# Altium schematic sheet ECU_Sheet.SchDoc
size 420 x 297 mm; SheetNumber: 1; SheetTotal: 5
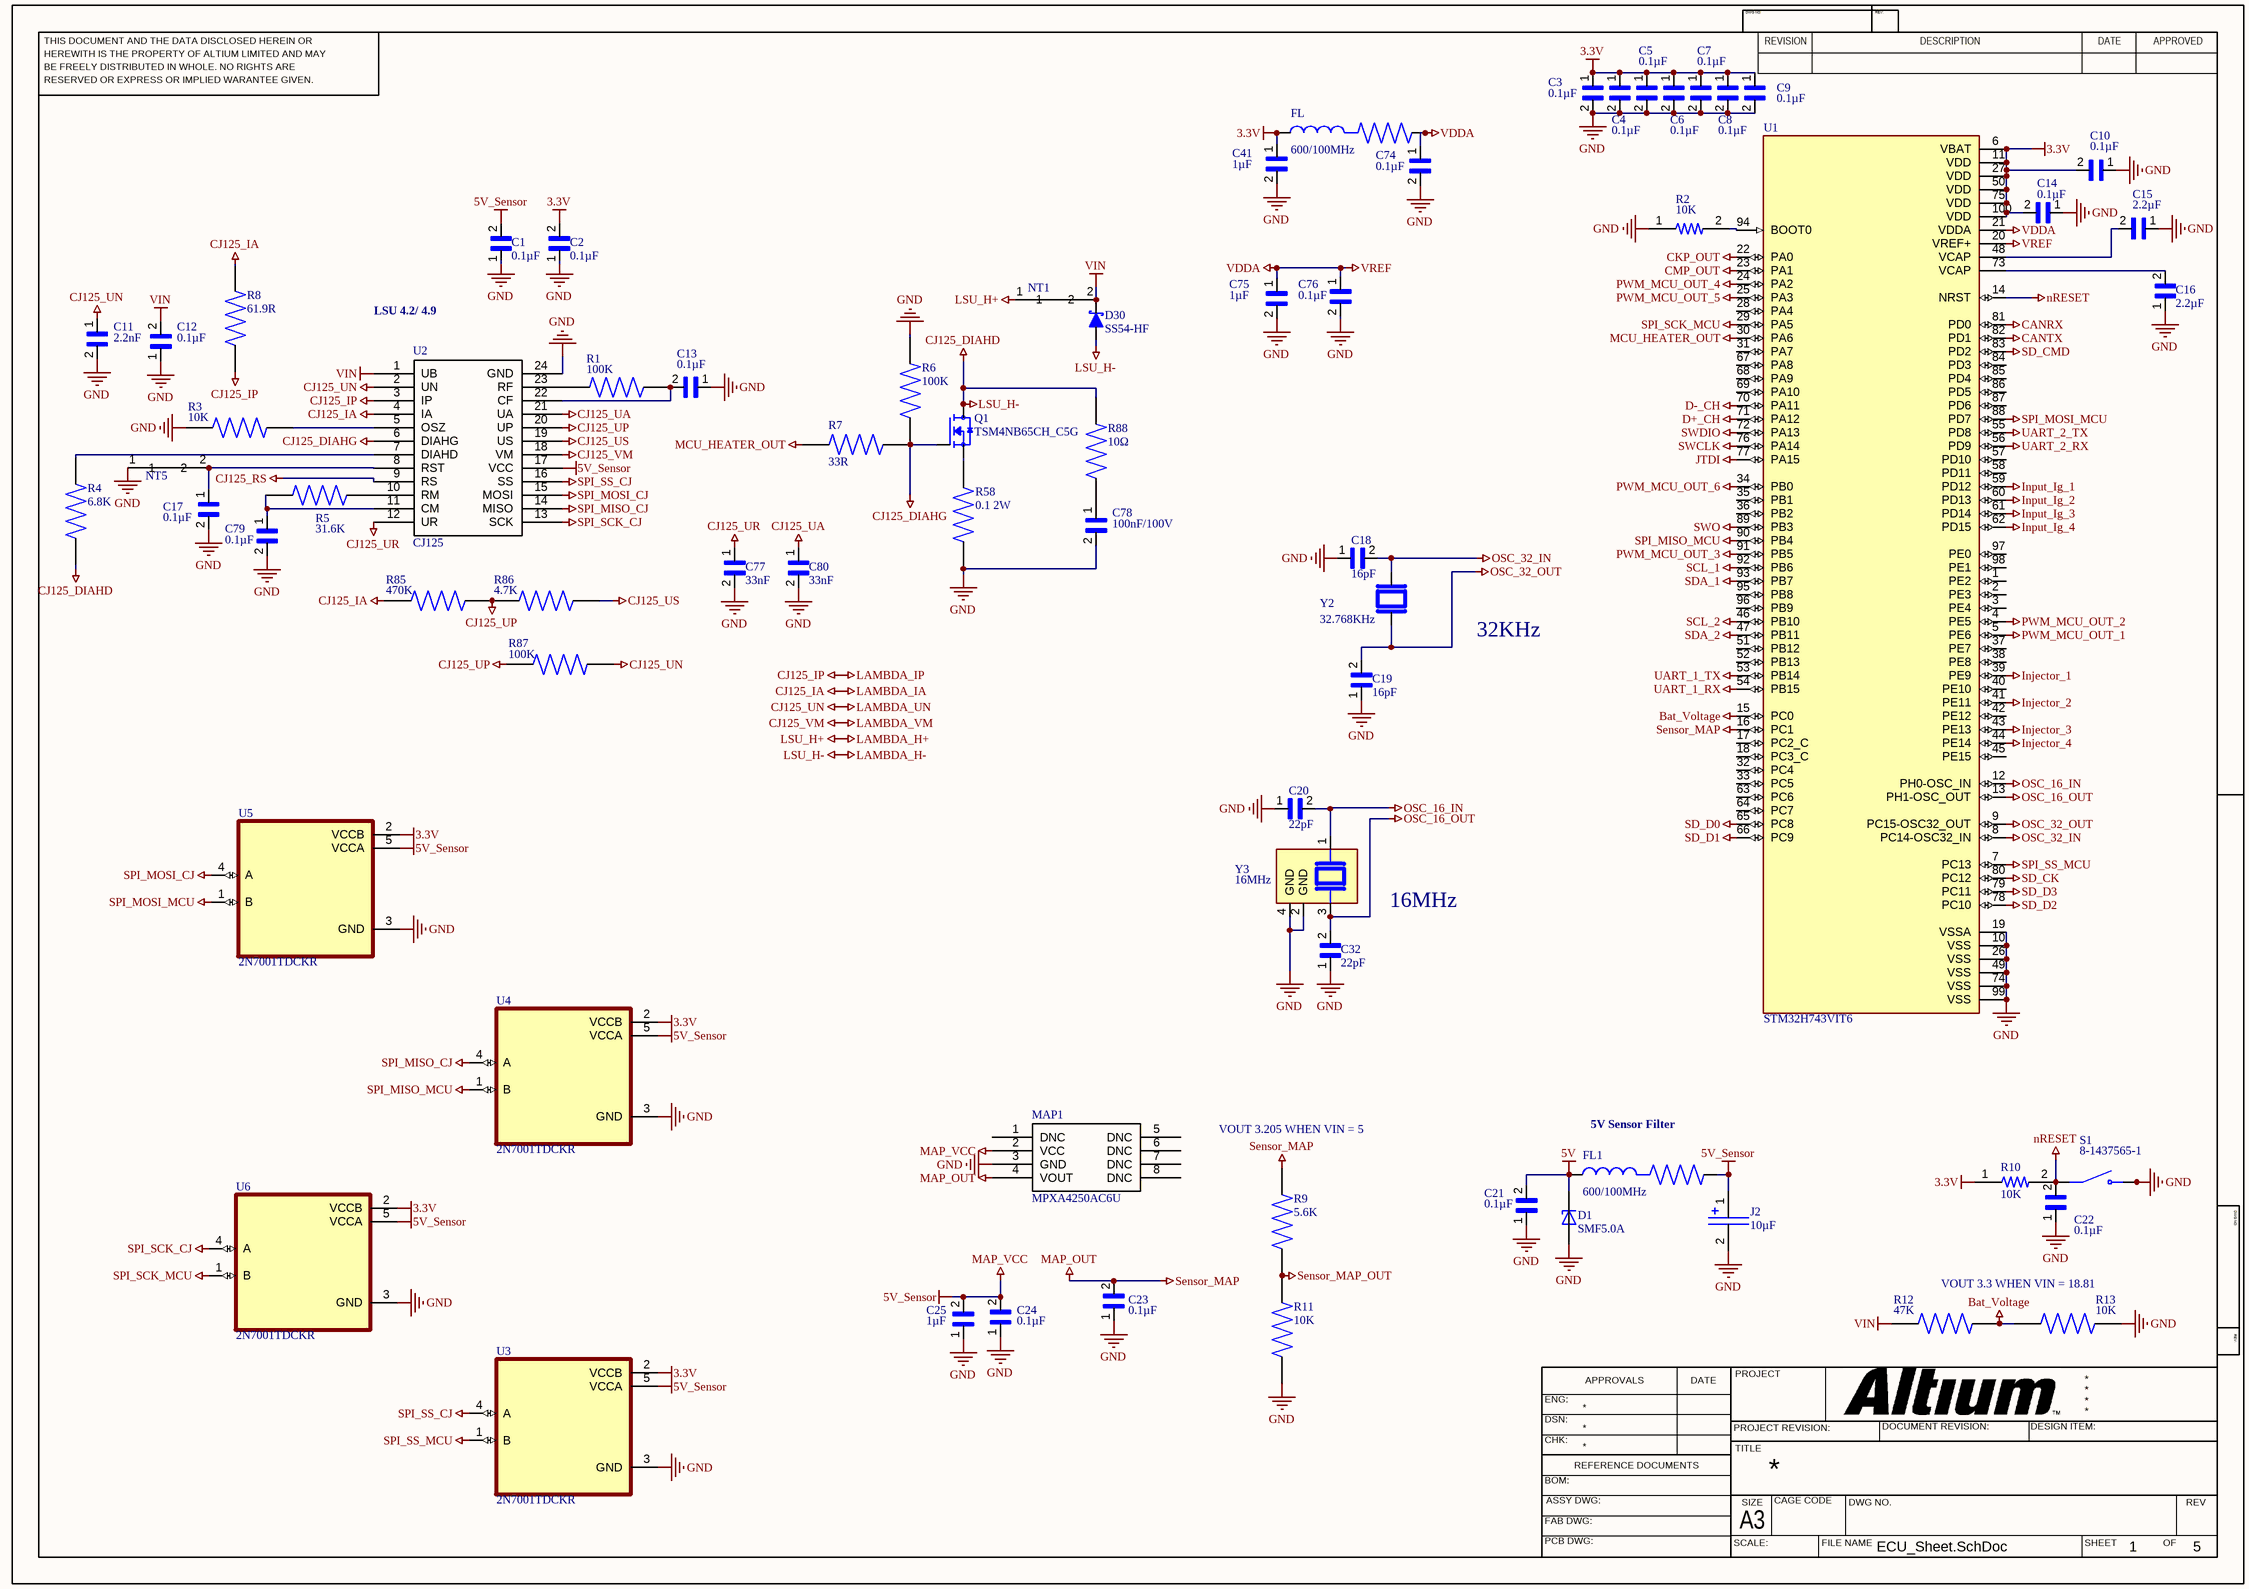
[diagram p0: ECU_Sheet.SchDoc]

## Parts
C1  0.1µF  [CAPC1608X90N]
C2  0.1µF  [CAPC1608X90N]
C3  0.1µF  [CAPC1608X90N]
C4  0.1µF  [CAPC1608X90N]
C5  0.1µF  [CAPC1608X90N]
C6  0.1µF  [CAPC1608X90N]
C7  0.1µF  [CAPC1608X90N]
C8  0.1µF  [CAPC1608X90N]
C9  0.1µF  [CAPC1608X90N]
C10  0.1µF  [CAPC1608X90N]
C11  2.2nF  [CAPC1608X90N]
C12  0.1µF  [CAPC1608X90N]
C13  0.1µF  [CAPC1608X90N]
C14  0.1µF  [CAPC1608X90N]
C15  2.2µF  [CAPC1608X90N]
C16  2.2µF  [CAPC1608X90N]
C17  0.1µF  [CAPC1608X90N]
C18  16pF  [CAPC1608X90N]
C19  16pF  [CAPC1608X90N]
C20  22pF  [CAPC1608X90N]
C21  0.1µF  [CAPC1608X90N]
C22  0.1µF  [CAPC1608X90N]
C23  0.1µF  [CAPC1608X90N]
C24  0.1µF  [CAPC1608X90N]
C25  1µF  [CAPC1608X90N]
C32  22pF  [CAPC1608X90N]
C41  1µF  [CAPC1608X90N]
C74  0.1µF  [CAPC1608X90N]
C75  1µF  [CAPC1608X90N]
C76  0.1µF  [CAPC1608X90N]
C77  33nF  [CAPC1608X90N]
C78  100nF/100V  [CAPC1608X90N]
C79  0.1µF  [CAPC1608X90N]
C80  33nF  [CAPC1608X90N]
D1  SMF5.0A  [SODFL3718X102N]
D30  SS54-HF  [DIOM5025X220N]
FL  600/100MHz  [BEADC1608X95N]
FL1  600/100MHz  [BEADC1608X95N]
J2  10µF  [T491A106K010AT]
MAP1  MPXA4250AC6U  [SOIC127P1041X990-8N]
NT1  (no value)  [NetTie]  (net tie, no BOM)
NT5  NT  [NetTie]  (value not drawn)  (net tie, no BOM)
Q1  TSM4NB65CH_C5G  [TO228P680X240X837-3]
R1  100K  [RESC3116X65N]
R2  10K  [RESC1608X50N]
R3  10K  [RESC3116X65N]
R4  6.8K  [RESC3116X65N]
R5  31.6K  [RESC3116X65N]
R6  100K  [RESC3116X65N]
R7  33R  [RESC3116X65N]
R8  61.9R  [RESC3116X65N]
R9  5.6K  [RESC3116X65N]
R10  10K  [RESC1608X50N]
R11  10K  [RESC3116X65N]
R12  47K  [RESC3116X65N]
R13  10K  [RESC3116X65N]
R58  0.1 2W  [RESC6331X80N]
R85  470K  [RESC3116X65N]
R86  4.7K  [RESC3116X65N]
R87  100K  [RESC3116X65N]
R88  10Ω  [RESC3116X65N]
S1  8-1437565-1  [SW_8-1437565-1]
U1  STM32H743VIT6  [QFP50P1600X1600X160-100N]
U2  CJ125  [CJ125]
U3  2N7001TDCKR  [SOT65P210X110-5N]
U4  2N7001TDCKR  [SOT65P210X110-5N]
U5  2N7001TDCKR  [SOT65P210X110-5N]
U6  2N7001TDCKR  [SOT65P210X110-5N]
Y2  32.768KHz  [XTAL_ABS06-32.768KHZ-9-1-T]
Y3  16MHz  [XTAL_7M25090002]

## Nets
3.3V: C2.2 C3.1 C4.1 C5.1 C6.1 C7.1 C8.1 C9.1 C10.2 C14.2 C41.1 FL.1 R10.1 U1.6(VBAT) U1.11(VDD) U1.27(VDD) U1.50(VDD) U1.75(VDD) U1.100(VDD) U3.2(VCCB) U4.2(VCCB) U5.2(VCCB) U6.2(VCCB)
5V: C21.2 D1.C FL1.1
5V_Sensor: C1.2 C24.2 C25.2 FL1.2 J2.1(P$1) MAP1.2(VCC) U2.17(VCC) U3.5(VCCA) U4.5(VCCA) U5.5(VCCA) U6.5(VCCA)  [also labelled MAP_VCC]
Bat_Voltage: R12.2 R13.1 U1.15(PC0)
CANRX: U1.81(PD0)
CANTX: U1.82(PD1)
CJ125_DIAHD: D30.2(A) Q1.2(D) R4.1 R88.2  [also labelled LAMBDA_H-, LSU_H-]
CJ125_DIAHG: Q1.1(G) R6.1 R7.2 U2.6(DIAHG)
CJ125_IA: R8.1 R85.1 U2.4(IA)  [also labelled LAMBDA_IA]
CJ125_IP: R8.2 U2.3(IP)  [also labelled LAMBDA_IP]
CJ125_RS: U2.9(RS)
CJ125_UA: C80.1 U2.21(UA)
CJ125_UN: C11.1 R87.2 U2.2(UN)  [also labelled LAMBDA_UN]
CJ125_UP: R85.2 R86.1 R87.1 U2.20(UP)
CJ125_UR: C77.1 U2.12(UR)
CJ125_US: R86.2 U2.19(US)
CJ125_VM: U2.18(VM)  [also labelled LAMBDA_VM]
CKP_OUT: U1.22(PA0)
CMP_OUT: U1.23(PA1)
D+_CH: U1.71(PA12)
D-_CH: U1.70(PA11)
GND: C1.1 C2.1 C3.2 C4.2 C5.2 C6.2 C7.2 C8.2 C9.2 C10.1 C11.2 C12.1 C13.1 C14.1 C15.1 C16.1 C17.2 C18.1 C19.1 C20.1 C21.1 C22.1 C23.1 C24.1 C25.1 C32.1 C41.2 C74.2 C75.2 C76.2 C77.2 C78.2 C79.2 C80.2 D1.A J2.2(P$2) MAP1.3(GND) NT5.1 R2.1 R3.1 R6.2 R11.1 R13.2 R58.2 S1.3(NO) S1.4(NO) U1.10(VSS) U1.19(VSSA) U1.26(VSS) U1.49(VSS) U1.74(VSS) U1.99(VSS) U2.24(GND) U3.3(GND) U4.3(GND) U5.3(GND) U6.3(GND) Y3.2(GND) Y3.4(GND)
Injector_1: U1.39(PE9)
Injector_2: U1.41(PE11)
Injector_3: U1.43(PE13)
Injector_4: U1.44(PE14)
Input_Ig_1: U1.59(PD12)
Input_Ig_2: U1.60(PD13)
Input_Ig_3: U1.61(PD14)
Input_Ig_4: U1.62(PD15)
JTDI: U1.77(PA15)
LAMBDA_H+: NT1.1  [also labelled LSU_H+]
MAP_OUT: C23.2 MAP1.4(VOUT) R9.1 U1.16(PC1)  [also labelled Sensor_MAP]
MCU_HEATER_OUT: R7.1 U1.30(PA6)
nRESET: C22.2 R10.2 S1.1(COM) S1.2(COM) U1.14(NRST)
OSC_16_IN: C20.2 U1.12(PH0-OSC_IN) Y3.1
OSC_16_OUT: C32.2 U1.13(PH1-OSC_OUT) Y3.3
OSC_32_IN: C18.2 U1.8(PC14-OSC32_IN) Y2.2
OSC_32_OUT: C19.2 U1.9(PC15-OSC32_OUT) Y2.1
PWM_MCU_OUT_1: U1.5(PE6)
PWM_MCU_OUT_2: U1.4(PE5)
PWM_MCU_OUT_3: U1.91(PB5)
PWM_MCU_OUT_4: U1.24(PA2)
PWM_MCU_OUT_5: U1.25(PA3)
PWM_MCU_OUT_6: U1.34(PB0)
SCL_1: U1.92(PB6)
SCL_2: U1.46(PB10)
SD_CK: U1.80(PC12)
SD_CMD: U1.83(PD2)
SD_D0: U1.65(PC8)
SD_D1: U1.66(PC9)
SD_D2: U1.78(PC10)
SD_D3: U1.79(PC11)
SDA_1: U1.93(PB7)
SDA_2: U1.47(PB11)
Sensor_MAP_OUT: R9.2 R11.2
SPI_MISO_CJ: U2.14(MISO) U4.4(A)
SPI_MISO_MCU: U1.90(PB4) U4.1(B)
SPI_MOSI_CJ: U2.15(MOSI) U5.4(A)
SPI_MOSI_MCU: U1.88(PD7) U5.1(B)
SPI_SCK_CJ: U2.13(SCK) U6.4(A)
SPI_SCK_MCU: U1.29(PA5) U6.1(B)
SPI_SS_CJ: U2.16(SS) U3.4(A)
SPI_SS_MCU: U1.7(PC13) U3.1(B)
SWCLK: U1.76(PA14)
SWDIO: U1.72(PA13)
SWO: U1.89(PB3)
UART_1_RX: U1.54(PB15)
UART_1_TX: U1.53(PB14)
UART_2_RX: U1.56(PD9)
UART_2_TX: U1.55(PD8)
VDDA: C74.1 C75.1 C76.1 FL.2 U1.20(VREF+) U1.21(VDDA)  [also labelled VREF]
VIN: C12.2 D30.1(K) NT1.2 R12.1 U2.1(UB)
NetC13_2: C13.2 R1.2 U2.22(CF)
NetC15_2: C15.2 U1.48(VCAP)
NetC16_2: C16.2 U1.73(VCAP)
NetC17_1: C17.1 NT5.2 U2.8(RST)
NetC78_1: C78.1 R88.1
NetC79_1: C79.1 R5.1 U2.11(CM)
NetQ1_3: Q1.3(S) R58.1
NetR1_1: R1.1 U2.23(RF)
NetR2_2: R2.2 U1.94(BOOT0)
NetR3_2: R3.2 U2.5(OSZ)
NetR4_2: R4.2 U2.7(DIAHD)
NetR5_2: R5.2 U2.10(RM)

Not connected (* = marked no-connect by the designer): MAP1 1(DNC) 5(DNC) 6(DNC) 7(DNC) 8(DNC); U1 1(PE2) 2(PE3) 3(PE4) 17(PC2_C) 18(PC3_C) 28(PA4) 31(PA7) 32(PC4) 33(PC5) 35(PB1) 36(PB2) 37(PE7) 38(PE8) 40(PE10) 42(PE12) 45(PE15) 51(PB12) 52(PB13) 57(PD10) 58(PD11) 63(PC6) 64(PC7) 67(PA8) 68(PA9) 69(PA10) 84(PD3) 85(PD4) 86(PD5) 87(PD6) 95(PB8) 96(PB9) 97(PE0) 98(PE1)

## Notes on the sheet
- LSU 4.2/ 4.9
- 32KHz
- 16MHz
- VOUT 3.205 WHEN VIN = 5
- (near FL1) 5V Sensor Filter
- VOUT 3.3 WHEN VIN = 18.81
- THIS DOCUMENT AND THE DATA DISCLOSED HEREIN OR
- HEREWITH IS THE PROPERTY OF ALTIUM LIMITED AND MAY
- DWG NO:
- REVISION
- REV:
- DESCRIPTION
- DATE
- APPROVED
- BE FREELY DISTRIBUTED IN WHOLE. NO RIGHTS ARE
- RESERVED OR EXPRESS OR IMPLIED WARANTEE GIVEN.
- ENG:
- APPROVALS
- PROJECT
- DSN:
- CHK:
- REFERENCE DOCUMENTS
- PROJECT REVISION:
- TITLE
- DOCUMENT REVISION:
- DESIGN ITEM:
- BOM:
- FAB DWG:
- PCB DWG:
- ASSY DWG:
- SCALE:
- A3
- SIZE
- CAGE CODE
- FILE NAME
- DWG NO.
- SHEET
- OF
- REV

## Library data of the parts
C1-C25 C32 C41 C74-C80 = 06035C104MAZ2A: Multilayer Ceramic Capacitors MLCC - SMD/SMT; Package: None; Price: None; Value: *; MP: 06035C104MAZ2A; Availability: Unavailable
D1 = SMF5.0A: 200W, 6.7V, 5%, Unidirectional, TVS; MF: Taiwan Semiconductor; SnapEDA_Link: https://www.snapeda.com/parts/SMF5.0A/taiwan/view-part/?ref=snap; Package: SOD-123W-2 Taiwan Semiconductor; Value: *; MP: SMF5.0A; Check_prices: https://www.snapeda.com/parts/SMF5.0A/taiwan/view-part/?ref=eda
D30 = SS54-HF: Diode Schottky 40 V 5A Surface Mount DO-214AC (SMA); MF: Comchip Technology; SnapEDA_Link: https://www.snapeda.com/parts/SS54-HF/Comchip/view-part/?ref=snap; Package: DO-214AC-214 Comchip Technology; Value: *; MP: SS54-HF; Check_prices: https://www.snapeda.com/parts/SS54-HF/Comchip/view-part/?ref=eda
FL FL1 = BLM18DN601SZ1D: 600 Ohms @ 100MHz 1 Ferrite Bead 0603 _1608 Metric_ 700mA; MF: Murata; Package: 1608 Murata; Availability: Unavailable; Value: *; MP: BLM18DN601SZ1D; SnapEDA_Link: https://www.snapeda.com/parts/BLM18DN601SZ1D/Murata/view-part/4302620/?ref=snap; Price: None
J2 = T491A106K010AT: Condensador electrolÃ­tico de tantalio sÃ³lido MnO2 de 10 ÂµF, 10 V CC +/-10 %, serie T491 ¦ KEMET T491A106K010AT; SnapEDA_Link: https://www.snapeda.com/parts/T491A106K010AT/KEMET/view-part/?ref=snap; Package: SMD-2 KEMET; Value: *; MF: KEMET; MP: T491A106K010AT; Check_prices: https://www.snapeda.com/parts/T491A106K010AT/KEMET/view-part/?ref=eda
NT1 = NT
Q1 = TSM4NB65CH_C5G: 650V, 4A, Single N-Channel Power MOSFET; MF: Taiwan Semiconductor; MP: TSM4NB65CH C5G; SnapEDA_Link: https://www.snapeda.com/parts/TSM4NB65CH%20C5G/Taiwan+Semiconductor/view-part/?ref=snap; Package: TO-251 Taiwan Semiconductor; Value: *; Check_prices: https://www.snapeda.com/parts/TSM4NB65CH%20C5G/Taiwan+Semiconductor/view-part/?ref=eda
R1 R3-R9 R11-R13 R85-R88 = AA1206JR-07470RL: Package: None; Price: None; Value: *; MP: AA1206JR-07470RL; Availability: Unavailable
R2 R10 = RP73PF1J10KBTDF: Thin Film Resistors - SMD 10K OHM .1% 25PPM; Voltage_Rating: 75 V; Power_Rating: .166 W; MF: TE Connectivity; Mouser-Purchase-URL: https://snapeda.com/shop?store=Mouser&id=550687; Value: *; SnapEDA_Link: https://www.snapeda.com/parts/RP73PF1J10KBTDF/TE%20Connectivity%20Passive%20Product/view-part/550687/?ref=snap; MP: RP73PF1J10KBTDF; Tolerance: .1%; Digi-Key_Part_Number: A110204CT-ND; Resistance: 10K; Package: 0603
R58 = CRM2512-JX-R100ELF: Resistor,Thick Film,Res 0.1 Ohms,Pwr-Rtg 2 W,Tol 5%,SMT,2512 | Bourns CRM2512-JX-R100ELF; SnapEDA_Link: https://www.snapeda.com/parts/CRM2512-JX-R100ELF/Bourns/view-part/?ref=snap; Package: 6331 Bourns; Value: *; MF: Bourns; MP: CRM2512-JX-R100ELF; Check_prices: https://www.snapeda.com/parts/CRM2512-JX-R100ELF/Bourns/view-part/?ref=eda
U1 = STM32H743VIT6: ARMÂ® CortexÂ®-M7 STM32H7 Microcontroller IC 32-Bit Single-Core 480MHz 2MB (2M x 8) FLASH 100-LQFP (14x14); MF: STMicroelectronics; SnapEDA_Link: https://www.snapeda.com/parts/STM32H743VIT6/STMicroelectronics/view-part/?ref=snap; Package: LQFP-100 STMicroelectronics; Value: *; MP: STM32H743VIT6; Check_prices: https://www.snapeda.com/parts/STM32H743VIT6/STMicroelectronics/view-part/?ref=eda
U3-U6 = 2N7001TDCKR: 1-bit dual-supply buffered voltage signal converter; MF: Texas Instruments; SnapEDA_Link: https://www.snapeda.com/parts/2N7001TDCKR/Texas+Instruments/view-part/?ref=snap; Package: SC70-5 Texas Instruments; Value: *; MP: 2N7001TDCKR; Check_prices: https://www.snapeda.com/parts/2N7001TDCKR/Texas+Instruments/view-part/?ref=eda
Y2 = ABS06-32.768KHZ-9-1-T: 32.768 kHz Â±10ppm Crystal 9pF 90 kOhms 2-SMD, No Lead; MF: Abracon; Availability: In Stock; Value: *; Purchase-URL: https://pricing.snapeda.com/search/part/ABS06-32.768KHZ-9-1-T/?ref=eda; Price: None; Check_prices: https://www.snapeda.com/parts/ABS06-32.768KHZ-9-1-T/Abracon+LLC/view-part/?ref=eda; MP: ABS06-32.768KHZ-9-1-T; Package: SMD-2 Abracon LLC; SnapEDA_Link: https://www.snapeda.com/parts/ABS06-32.768KHZ-9-1-T/Abracon+LLC/view-part/?ref=snap
Y3 = 7M25090002: 25 MHz Â±10ppm Crystal 18pF 4-SMD, No Lead; MF: TXC; Availability: In Stock; Check_prices: https://www.snapeda.com/parts/7M25090002/TXC/view-part/?ref=eda; Price: None; SnapEDA_Link: https://www.snapeda.com/parts/7M25090002/TXC/view-part/?ref=snap; MP: 7M25090002; Value: *; Purchase-URL: https://pricing.snapeda.com/search/part/7M25090002/?ref=eda; Package: SMD-4 TXC
S1 = 8-1437565-1: Package: None; MP: 8-1437565-1; Price: None; Availability: Unavailable; Value: *